# Altium schematic sheet 017_SoC CSI & OLDI.SchDoc
size 420 x 297 mm; Page Create Date: May 29, 2006; WebSite: https://www.seeedstudio.com; Variant Name: <Core Design>; Page Number: 17; Drawing: qxn; Schematic Name: BeaglePlay; Page Size: A3; Comment: Seeed Title; Page Count: 22; Page Name: 017_SoC CSI & OLDI; Company: Seeed Studio; RevCode: v0.2; DsnPath: C:\Users\a0488739\Documents\GitHub\beagleplay\allegro\DVT\BEAGLEPLAYV020_220915.DSN; SchematicName: BeaglePlay; PageName: 017_SoC CSI & OLDI; PageSize: A3; TopSchematic: True
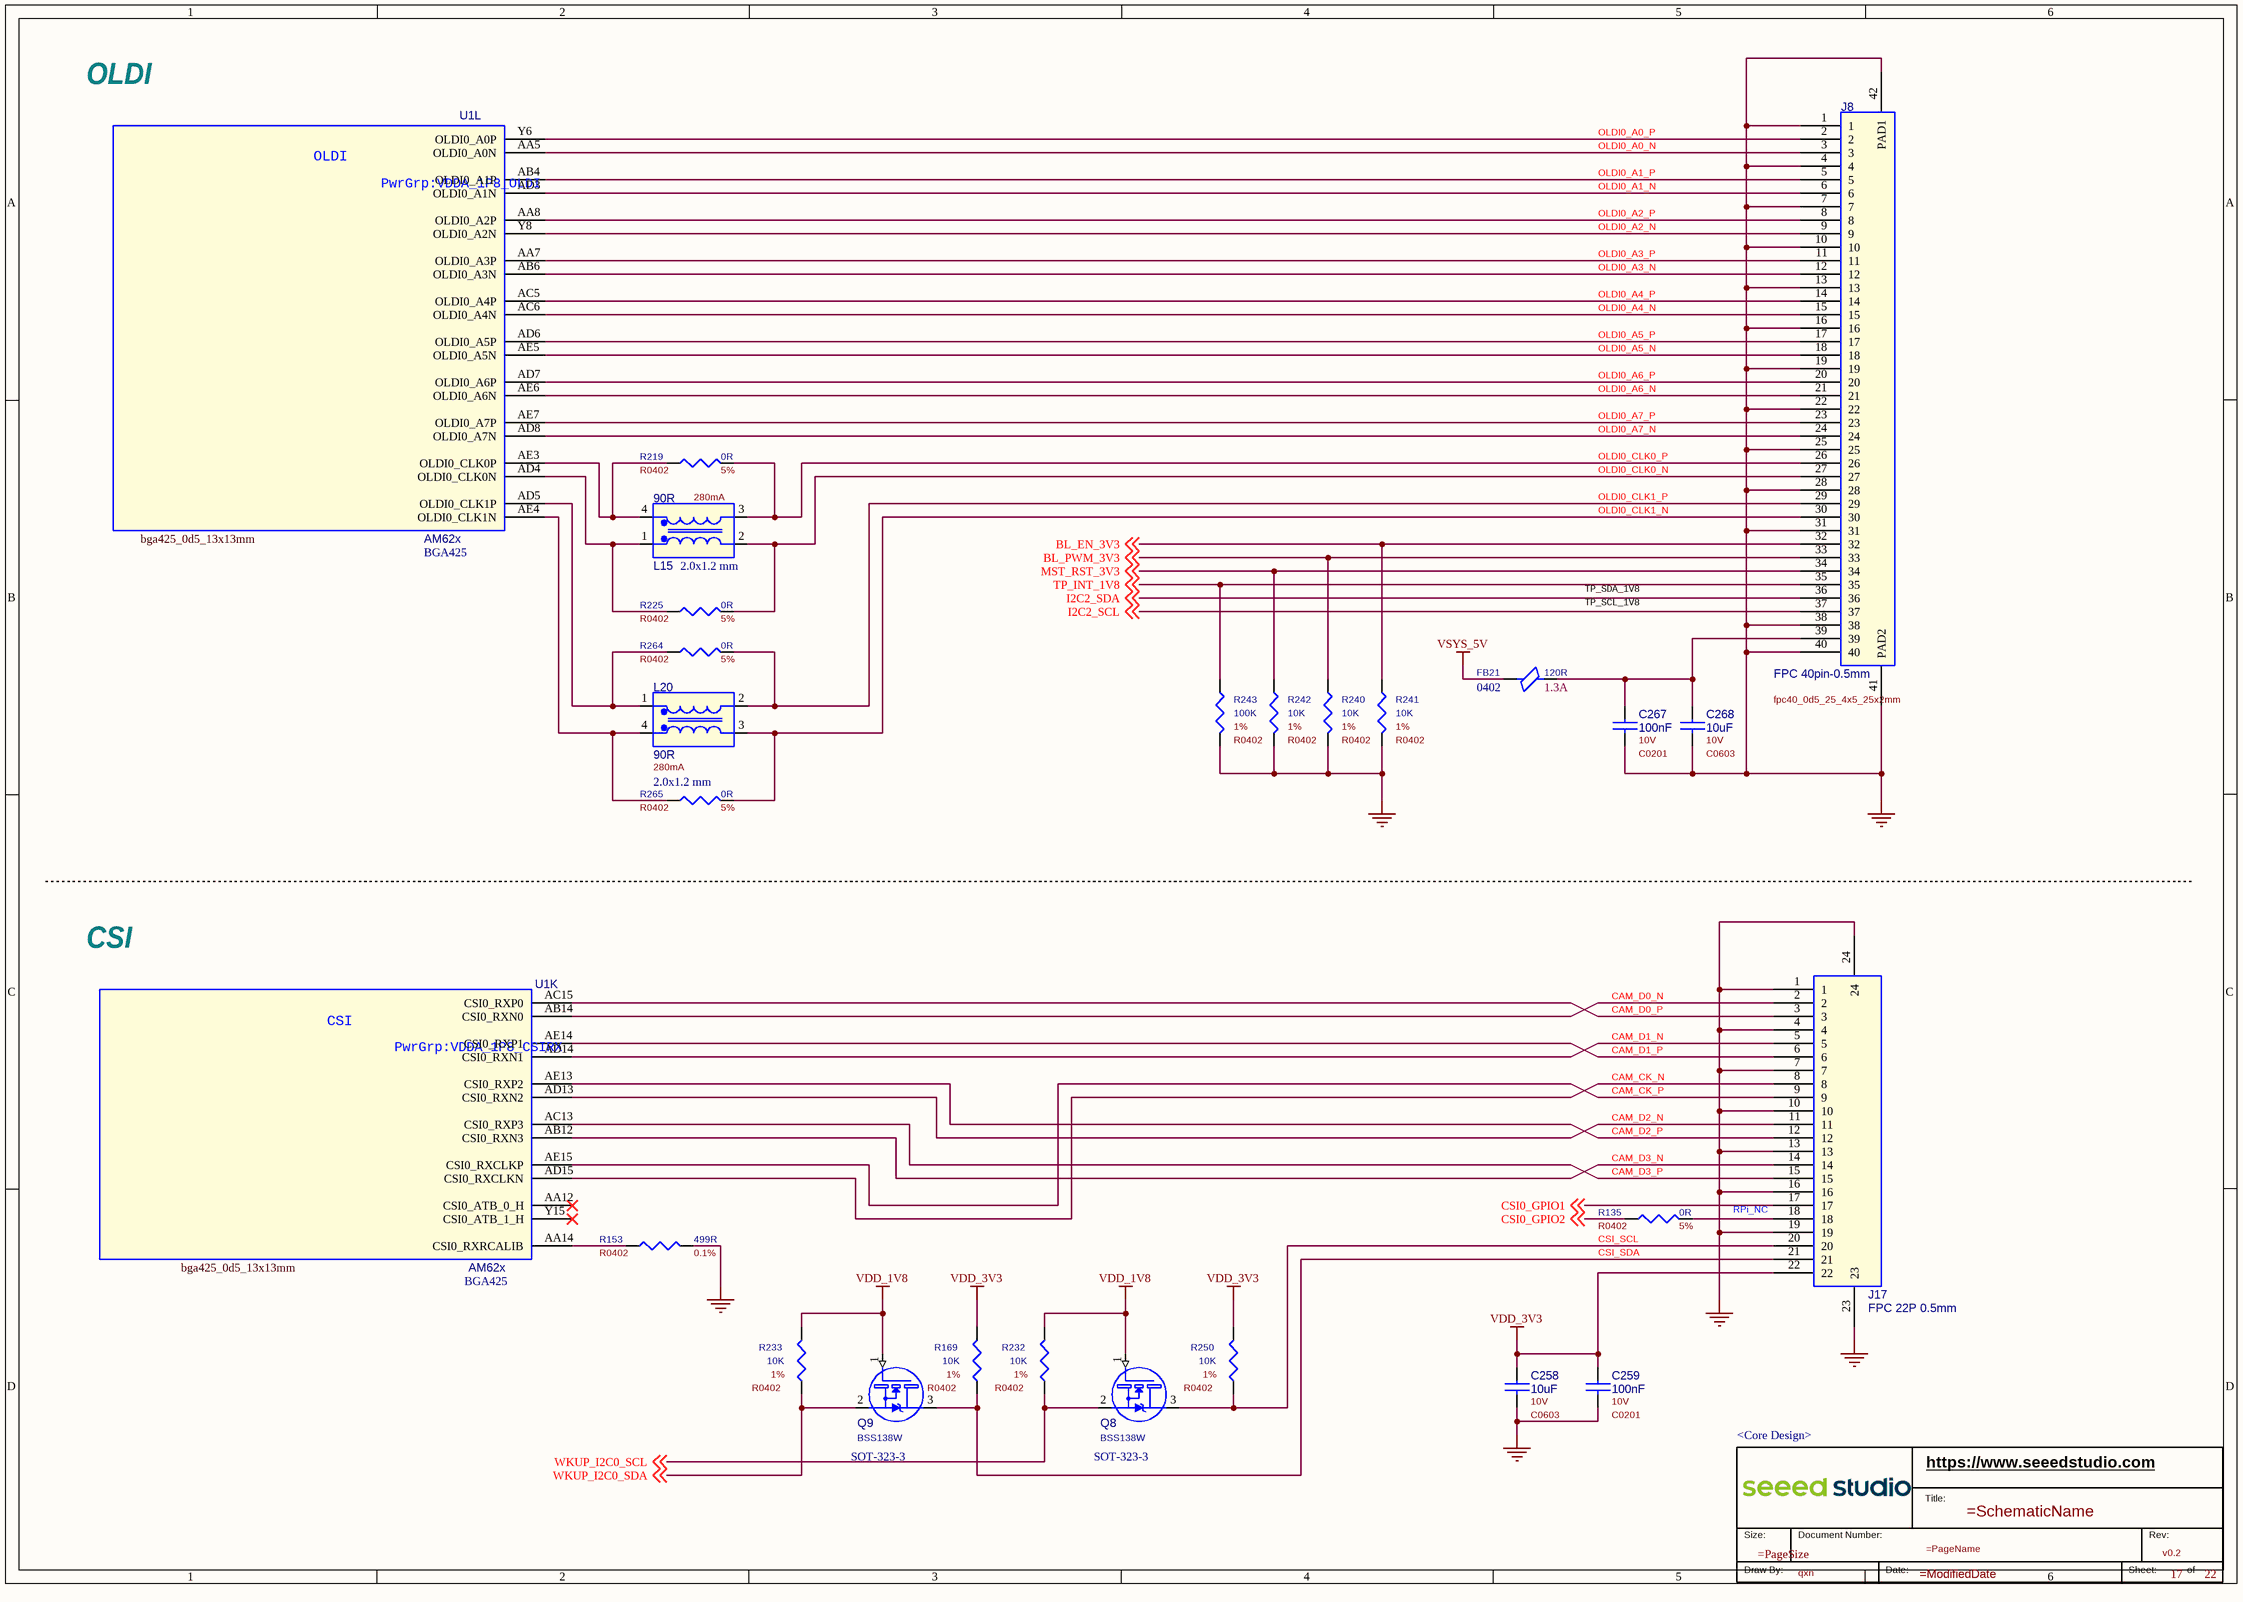
[diagram p0: 017_SoC CSI & OLDI.SchDoc]

## Parts
*  RevCode: v0.2  Page Number: 17  Page Count: 22  Drawing: qxn  Variant Name: <Core Design>  (hidden comment: Seeed Title)  (graphical)
C258  value 10uF  Rating: 10V  [C0603]  (hidden comment: CC)
C259  value 100nF  Rating: 10V  [C0201]  (hidden comment: CC)
C267  value 100nF  Rating: 10V  [C0201]  (hidden comment: CC)
C268  value 10uF  Rating: 10V  [C0603]  (hidden comment: CC)
FB21  value 120R  Rating: 1.3A  Package Size: 0402  [L0402]  (hidden comment: FB)
J8  value FPC 40pin-0.5mm  [fpc40_0d5_25_4x5_25x2mm]  (hidden comment: Header 40+2P)
J17  value FPC 22P 0.5mm  [fpc22_0d5_15_4x5_25x2mm_0d5_dx_npwb]  (hidden comment: FPC 22+2P)
L15  value 90R  Rating: 280mA  Package Size: 2.0x1.2 mm  [L2012]  (hidden comment: CL)
L20  value 90R  Rating: 280mA  Package Size: 2.0x1.2 mm  [L2012]  (hidden comment: CL)
Q8  value BSS138W  [SOT-323-3]  (hidden comment: NMOS_123)
Q9  value BSS138W  [SOT-323-3]  (hidden comment: NMOS_123)
R135  value 0R  Rating: 5%  [R0402]  (hidden comment: R)
R153  value 499R  Rating: 0.1%  [R0402]  (hidden comment: R)
R169  value 10K  Rating: 1%  [R0402]  (hidden comment: R)
R219  value 0R  Rating: 5%  [R0402]  (hidden comment: R)
R225  value 0R  Rating: 5%  [R0402]  (hidden comment: R)
R232  value 10K  Rating: 1%  [R0402]  (hidden comment: R)
R233  value 10K  Rating: 1%  [R0402]  (hidden comment: R)
R240  value 10K  Rating: 1%  [R0402]  (hidden comment: R)
R241  value 10K  Rating: 1%  [R0402]  (hidden comment: R)
R242  value 10K  Rating: 1%  [R0402]  (hidden comment: R)
R243  value 100K  Rating: 1%  [R0402]  (hidden comment: R)
R250  value 10K  Rating: 1%  [R0402]  (hidden comment: R)
R264  value 0R  Rating: 5%  [R0402]  (hidden comment: R)
R265  value 0R  Rating: 5%  [R0402]  (hidden comment: R)
U1  value AM62x  Package Size: BGA425  [bga425_0d5_13x13mm]  (hidden comment: AM62x_BGA425)  (parts K,L of 19)

## Nets
GND: C258.2 C259.2 C267.2 C268.2 J8.1 J8.4 J8.7 J8.10 J8.13 J8.16 J8.19 J8.22 J8.25 J8.28 J8.31 J8.38 J8.40 J8.41(PAD2) J8.42(PAD1) J17.1 J17.4 J17.7 J17.10 J17.13 J17.16 J17.19 J17.23 J17.24 R153.2 R240.2 R241.2 R242.2 R243.2
VDD_1V8: Q8.1(G) Q9.1(G) R232.1 R233.1
VDD_3V3: C258.1 C259.1 J17.22 R169.1 R250.1
VSYS_5V: FB21.1
BL_EN_3V3: J8.32 R241.1 ; off-sheet BL_EN_3V3
BL_PWM_3V3: J8.33 R240.1 ; off-sheet BL_PWM_3V3
CAM_CK_N: J17.8 U1.AD15(CSI0_RXCLKN)
CAM_CK_P: J17.9 U1.AE15(CSI0_RXCLKP)
CAM_D0_N: J17.2 U1.AB14(CSI0_RXN0)
CAM_D0_P: J17.3 U1.AC15(CSI0_RXP0)
CAM_D1_N: J17.5 U1.AD14(CSI0_RXN1)
CAM_D1_P: J17.6 U1.AE14(CSI0_RXP1)
CAM_D2_N: J17.11 U1.AD13(CSI0_RXN2)
CAM_D2_P: J17.12 U1.AE13(CSI0_RXP2)
CAM_D3_N: J17.14 U1.AB12(CSI0_RXN3)
CAM_D3_P: J17.15 U1.AC13(CSI0_RXP3)
CSI0_GPIO1: J17.17 ; off-sheet CSI0_GPIO1
CSI0_GPIO2: R135.1 ; off-sheet CSI0_GPIO2
CSI_SCL: J17.20 Q8.3(D) R250.2
CSI_SDA: J17.21 Q9.3(D) R169.2
I2C2_SCL: J8.37 ; off-sheet I2C2_SCL
I2C2_SDA: J8.36 ; off-sheet I2C2_SDA
MST_RST_3V3: J8.34 R242.1 ; off-sheet MST_RST_3V3
OLDI0_A0_N: J8.3 U1.AA5(OLDI0_A0N)
OLDI0_A0_P: J8.2 U1.Y6(OLDI0_A0P)
OLDI0_A1_N: J8.6 U1.AD3(OLDI0_A1N)
OLDI0_A1_P: J8.5 U1.AB4(OLDI0_A1P)
OLDI0_A2_N: J8.9 U1.Y8(OLDI0_A2N)
OLDI0_A2_P: J8.8 U1.AA8(OLDI0_A2P)
OLDI0_A3_N: J8.12 U1.AB6(OLDI0_A3N)
OLDI0_A3_P: J8.11 U1.AA7(OLDI0_A3P)
OLDI0_A4_N: J8.15 U1.AC6(OLDI0_A4N)
OLDI0_A4_P: J8.14 U1.AC5(OLDI0_A4P)
OLDI0_A5_N: J8.18 U1.AE5(OLDI0_A5N)
OLDI0_A5_P: J8.17 U1.AD6(OLDI0_A5P)
OLDI0_A6_N: J8.21 U1.AE6(OLDI0_A6N)
OLDI0_A6_P: J8.20 U1.AD7(OLDI0_A6P)
OLDI0_A7_N: J8.24 U1.AD8(OLDI0_A7N)
OLDI0_A7_P: J8.23 U1.AE7(OLDI0_A7P)
OLDI0_CLK0_N: J8.27 L15.2 R225.2
OLDI0_CLK0_P: J8.26 L15.3 R219.2
OLDI0_CLK1_N: J8.30 L20.3 R265.2
OLDI0_CLK1_P: J8.29 L20.2 R264.2
TP_INT_1V8: J8.35 R243.1 ; off-sheet TP_INT_1V8
WKUP_I2C0_SCL: Q8.2(S) R232.2 ; off-sheet WKUP_I2C0_SCL
WKUP_I2C0_SDA: Q9.2(S) R233.2 ; off-sheet WKUP_I2C0_SDA
NetC267_1: C267.1 C268.1 FB21.2 J8.39
NetJ17_18: J17.18 R135.2
NetL15_1: L15.1 R225.1 U1.AD4(OLDI0_CLK0N)
NetL15_4: L15.4 R219.1 U1.AE3(OLDI0_CLK0P)
NetL20_1: L20.1 R264.1 U1.AD5(OLDI0_CLK1P)
NetL20_4: L20.4 R265.1 U1.AE4(OLDI0_CLK1N)
NetR153_1: R153.1 U1.AA14(CSI0_RXRCALIB)

Not connected (* = marked no-connect by the designer): U1 AA12(CSI0_ATB_0_H)* Y15(CSI0_ATB_1_H)*

## Notes on the sheet
- OLDI
- TP_SDA_1V8
- TP_SCL_1V8
- CSI
- RPi_NC
- (in symbol AM62x_BGA425, part K) CSI; PwrGrp:VDDA_1P8_CSIRX
- (in symbol AM62x_BGA425, part L) OLDI; PwrGrp:VDDA_1P8_OLDI
- (in symbol Seeed Title) https://www.seeedstudio.com; Title:; Size:; Document Number:; Rev:; Draw By:; Date:; Sheet:; of

## Library data of the parts
* = Seeed Title: Company: Seeed Studio; WebSite: https://www.seeedstudio.com; Schematic Name: =SchematicName; Page Size: =PageSize; Page Name: =PageName; Page Create Date: May 29, 2006; Page Modify Date: =ModifiedDate
C258 = CC: CAP, Ceramic, SMD, 10uF, 10%, 10V, 0603; Part Reference: C258; Manufacturer PN: CC0603KRX5R6BB106; Company Part Status: BeagleBone Carrier Board; Manufacturer: YAGEO; Manufacturer Part Number: CC0805MKX7R7BB106; CLASS: DISCRETE; Temperature Coefficient: X5R; PN: 302010103; PCB Footprint: C0603; Tolerance: 10%; Dielectric Type: Ceramic; Package Size: 0603; Part Type: Ceramic; Status: Sensecap Gateway V1; Temperature: -55¡ãC to 125¡ãC
C259 = CC: CAP, Ceramic, SMD, 100nF, 10%, 10V, 0201; Part Reference: C259; Manufacturer PN: CC0201KRX5R6BB104; Company Part Status: ODYSSEY-i.MX8M; Manufacturer: YAGEO; CLASS: DISCRETE; Temperature Coefficient: X5R; PN: 302010271; PCB Footprint: C0201; Tolerance: 10%; Dielectric Type: Ceramic; Package Size: 0201; Temperature: -55¡ãC to 85¡ãC; Status: ODYSSEY-i.MX8M; Part Type: Ceramic; Manufacturer Part Number: CC0201KRX5R6BB104
C267 = CC: CAP, Ceramic, SMD, 100nF, 10%, 10V, 0201; Part Reference: C267; Manufacturer PN: CC0201KRX5R6BB104; Manufacturer: YAGEO; Company Part Status: ODYSSEY-i.MX8M; CLASS: DISCRETE; Temperature Coefficient: X5R; PN: 302010271; PCB Footprint: C0201; Tolerance: 10%; Dielectric Type: Ceramic; Package Size: 0201
C268 = CC: CAP, Ceramic, SMD, 10uF, 10%, 10V, 0603; Part Reference: C268; Manufacturer PN: CC0603KRX5R6BB106; Manufacturer: YAGEO; Company Part Status: BeagleBone Carrier Board; CLASS: DISCRETE; Temperature Coefficient: X5R; PN: 302010103; PCB Footprint: C0603; Tolerance: 10%; Dielectric Type: Ceramic; Package Size: 0603
FB21 = FB: Ferrite Bead, 120R, , 1.3A, 0402; Part Reference: FB21; Company Part Status: BeagleBone Carrier Board; Manufacturer: Murata; Manufacturer PN: BLM15PD121SN1D; PN: 303030040; CLASS: DISCRETE; PCB Footprint: L0402
J8 = Header 40+2P: CONN, FPC Connectors, 0.5K-DX-40PWB, 40P, SMD; Part Reference: J8; Company Part Status: BeaglePlay; Manufacturer: BEST Electronics; PN: 320060264; CLASS: IO; PCB Footprint: fpc40_0d5_25_4x5_25x2mm; Package Size: 40P-0.50mm; Manufacturer PN: 0.5K-DX-40PWB
J17 = FPC 22+2P: CONN, FPC Connectors, FPC 22P 0.5mm, 22P+2P, SMD; Part Reference: J17; Manufacturer Part Number: 0.5K-DX-22PWB; Manufacturer: BEST Electronics; Company Part Status: BeaglePlay; Priority: A; PN: 320060764; CLASS: IO; PCB Footprint: fpc22_0d5_15_4x5_25x2mm_0d5_dx_npwb; Temperature: -25¡ãC to 85¡ãC; Status: BeagleBone AI TDA4VM; Part Type: FPC Connector; Package Size: 20P-0.5mm; Manufacturer PN: 0.5K-DX-22PWB
L15 = CL: Common Mode Filter, 90R, --, 280mA, 2.0x1.2 mm; Part Reference: L15; Company Part Status: BBAI; Manufacturer: Murata; Manufacturer PN: DLW21SN900HQ2L; PN: 303050266; CLASS: DISCRETE; PCB Footprint: L2012
L20 = CL: Common Mode Filter, 90R, --, 280mA, 2.0x1.2 mm; Part Reference: L20; Manufacturer PN: DLW21SN900HQ2L; Manufacturer: Murata; Company Part Status: BBAI; CLASS: DISCRETE; PN: 303050266; PCB Footprint: L2012
Q8 = NMOS_123: XSTR, MOSFET, N-Channel, BSS138W, 50V, 200mA, SOT-323-3, SMD; Part Reference: Q8; Company Part Status: BeagleBone Carrier Board; Manufacturer: Diodes; Manufacturer PN: BSS138W-7-F; PN: 305030000; CLASS: DISCRETE; PCB Footprint: SOT-323-3; Package Size: SOT-323-3; Polarity: N-Channel
Q9 = NMOS_123: XSTR, MOSFET, N-Channel, BSS138W, 50V, 200mA, SOT-323-3, SMD; Part Reference: Q9; Company Part Status: BeagleBone Carrier Board; Manufacturer: Diodes; Manufacturer PN: BSS138W-7-F; PN: 305030000; CLASS: DISCRETE; PCB Footprint: SOT-323-3; Package Size: SOT-323-3; Polarity: N-Channel
R135 = R: RES, Thick Film, 0R, 5%, 1/16W, SMD, 0402; Part Reference: R135; Manufacturer PN: RC0402JR-070RL; Company Part Status: BeagleBone Carrier Board; Manufacturer Part Number: RC0201FR-070RL; Manufacturer: YAGEO; CLASS: DISCRETE; PN: 301010000; PCB Footprint: R0402; Rated Power: 1/16W; Package Size: 0402; Temperature: -55¡ãC to 125¡ãC; Status: BeagleBone AI TDA4VM; Part Type: RES
R153 = R: RES, Thick Film, 499R, 0.1%, 1/16W, SMD, 0402; Part Reference: R153; Company Part Status: Beaglebone LoRa Gateway; Manufacturer: YAGEO; Manufacturer PN: RT0402BRE07499RL; PN: 301010848; CLASS: DISCRETE; PCB Footprint: R0402; Package Size: 0402; Rated Power: 1/16W
R169 = R: RES, Thick Film, 10K, 1%, 1/16W, SMD, 0402; Part Reference: R169; Company Part Status: BeagleBone Carrier Board; Manufacturer: YAGEO; Manufacturer PN: RC0402FR-0710KL; PN: 301010047; CLASS: DISCRETE; PCB Footprint: R0402; Package Size: 0402; Rated Power: 1/16W
R219 = R: RES, Thick Film, 0R, 5%, 1/16W, SMD, 0402; Part Reference: R219; Manufacturer: YAGEO; Manufacturer Part Number: RC0201FR-070RL; Company Part Status: BeagleBone Carrier Board; Manufacturer PN: RC0402JR-070RL; PN: 301010000; CLASS: DISCRETE; PCB Footprint: R0402; Part Type: RES; Status: BeagleBone AI TDA4VM; Temperature: -55¡ãC to 125¡ãC; Package Size: 0402; Rated Power: 1/16W
R225 = R: RES, Thick Film, 0R, 5%, 1/16W, SMD, 0402; Part Reference: R225; Manufacturer: YAGEO; Manufacturer Part Number: RC0201FR-070RL; Company Part Status: BeagleBone Carrier Board; Manufacturer PN: RC0402JR-070RL; PN: 301010000; CLASS: DISCRETE; PCB Footprint: R0402; Part Type: RES; Status: BeagleBone AI TDA4VM; Temperature: -55¡ãC to 125¡ãC; Package Size: 0402; Rated Power: 1/16W
R232 = R: RES, Thick Film, 10K, 1%, 1/16W, SMD, 0402; Part Reference: R232; Manufacturer PN: RC0402FR-0710KL; Manufacturer: YAGEO; Company Part Status: BeagleBone Carrier Board; CLASS: DISCRETE; PN: 301010047; PCB Footprint: R0402; Package Size: 0402; Rated Power: 1/16W
R233 = R: RES, Thick Film, 10K, 1%, 1/16W, SMD, 0402; Part Reference: R233; Manufacturer PN: RC0402FR-0710KL; Manufacturer: YAGEO; Company Part Status: BeagleBone Carrier Board; CLASS: DISCRETE; PN: 301010047; PCB Footprint: R0402; Package Size: 0402; Rated Power: 1/16W
R240 = R: RES, Thick Film, 10K, 1%, 1/16W, SMD, 0402; Part Reference: R240; Manufacturer PN: RC0402FR-0710KL; Company Part Status: BeagleBone Carrier Board; Manufacturer Part Number: RC0201FR-0710KL; Manufacturer: YAGEO; CLASS: DISCRETE; PN: 301010047; PCB Footprint: R0402; Package Size: 0402; Temperature: -55¡ãC to 125¡ãC; Status: BeagleBone AI TDA4VM; Part Type: RES; Rated Power: 1/16W
R241 = R: RES, Thick Film, 10K, 1%, 1/16W, SMD, 0402; Part Reference: R241; Manufacturer PN: RC0402FR-0710KL; Company Part Status: BeagleBone Carrier Board; Manufacturer Part Number: RC0201FR-0710KL; Manufacturer: YAGEO; CLASS: DISCRETE; PN: 301010047; PCB Footprint: R0402; Package Size: 0402; Temperature: -55¡ãC to 125¡ãC; Status: BeagleBone AI TDA4VM; Part Type: RES; Rated Power: 1/16W
R242 = R: RES, Thick Film, 10K, 1%, 1/16W, SMD, 0402; Part Reference: R242; Manufacturer PN: RC0402FR-0710KL; Company Part Status: BeagleBone Carrier Board; Manufacturer Part Number: RC0201FR-0710KL; Manufacturer: YAGEO; CLASS: DISCRETE; PN: 301010047; PCB Footprint: R0402; Package Size: 0402; Temperature: -55¡ãC to 125¡ãC; Status: BeagleBone AI TDA4VM; Part Type: RES; Rated Power: 1/16W
R243 = R: RES, Thick Film, 100K, 1%, 1/16W, SMD, 0402; Part Reference: R243; Manufacturer PN: RC0402FR-07100KL; Company Part Status: BeagleBone Carrier Board; Manufacturer Part Number: RC0201FR-0710KL; Manufacturer: YAGEO; CLASS: DISCRETE; PN: 301010456; PCB Footprint: R0402; Package Size: 0402; Temperature: -55¡ãC to 125¡ãC; Status: BeagleBone AI TDA4VM; Part Type: RES; Rated Power: 1/16W
R250 = R: RES, Thick Film, 10K, 1%, 1/16W, SMD, 0402; Part Reference: R250; Company Part Status: BeagleBone Carrier Board; Manufacturer: YAGEO; Manufacturer PN: RC0402FR-0710KL; PN: 301010047; CLASS: DISCRETE; PCB Footprint: R0402; Package Size: 0402; Rated Power: 1/16W
R264 = R: RES, Thick Film, 0R, 5%, 1/16W, SMD, 0402; Part Reference: R264; Manufacturer: YAGEO; Manufacturer Part Number: RC0201FR-070RL; Company Part Status: BeagleBone Carrier Board; Manufacturer PN: RC0402JR-070RL; PN: 301010000; CLASS: DISCRETE; PCB Footprint: R0402; Part Type: RES; Status: BeagleBone AI TDA4VM; Temperature: -55¡ãC to 125¡ãC; Package Size: 0402; Rated Power: 1/16W
R265 = R: RES, Thick Film, 0R, 5%, 1/16W, SMD, 0402; Part Reference: R265; Manufacturer: YAGEO; Manufacturer Part Number: RC0201FR-070RL; Company Part Status: BeagleBone Carrier Board; Manufacturer PN: RC0402JR-070RL; PN: 301010000; CLASS: DISCRETE; PCB Footprint: R0402; Part Type: RES; Status: BeagleBone AI TDA4VM; Temperature: -55¡ãC to 125¡ãC; Package Size: 0402; Rated Power: 1/16W
U1 = AM62x_BGA425: IC, Controller, MPU, AM62x, BGA425; Part Reference: U1; Manufacturer PN: AM6254ATCGGHALWR; Manufacturer: TI; Company Part Status: BeaglePlay; PN: 310011537; PCB Footprint: bga425_0d5_13x13mm; CLASS: IC